# Altium schematic sheet TOP.SchDoc
size A4
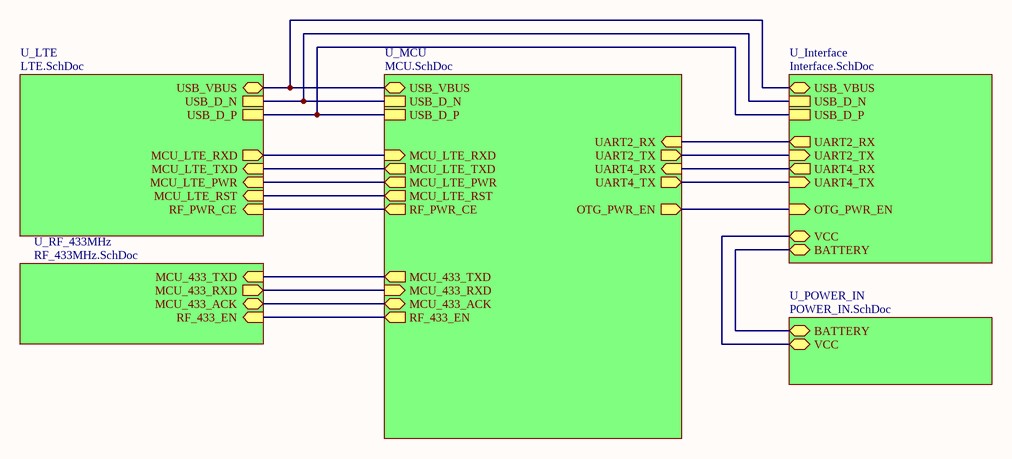
[diagram p0: TOP.SchDoc]

## Sub-sheets
U_Interface = Interface.SchDoc: USB_D_N, USB_D_P, UART2_TX (in), UART4_TX (in), UART2_RX (out), UART4_RX (out), OTG_PWR_EN (in), BATTERY (bidir), VCC (bidir), USB_VBUS (bidir)
U_LTE = LTE.SchDoc: USB_D_N, USB_D_P, MCU_LTE_RXD (out), MCU_LTE_TXD (in), MCU_LTE_PWR (in), MCU_LTE_RST (in), RF_PWR_CE (in), USB_VBUS (bidir)
U_MCU = MCU.SchDoc: USB_D_N, USB_D_P, MCU_LTE_TXD (out), MCU_LTE_RXD (in), MCU_LTE_PWR (out), MCU_LTE_RST (out), RF_PWR_CE (out), MCU_433_ACK (bidir), MCU_433_TXD (out), MCU_433_RXD (in), OTG_PWR_EN (out), UART2_RX (in), UART4_RX (in), UART2_TX (out), UART4_TX (out), RF_433_EN (out), USB_VBUS (bidir)
U_POWER_IN = POWER_IN.SchDoc: VCC (bidir), BATTERY (bidir)
U_RF_433MHz = RF_433MHz.SchDoc: MCU_433_ACK (bidir), MCU_433_TXD (in), MCU_433_RXD (out), RF_433_EN (in)

## Nets
(unnamed): sheet U_Interface/USB_D_N, sheet U_LTE/USB_D_N, sheet U_MCU/USB_D_N
(unnamed): sheet U_Interface/USB_D_P, sheet U_LTE/USB_D_P, sheet U_MCU/USB_D_P
(unnamed): sheet U_Interface/UART2_TX, sheet U_MCU/UART2_TX
(unnamed): sheet U_Interface/UART4_TX, sheet U_MCU/UART4_TX
(unnamed): sheet U_Interface/UART2_RX, sheet U_MCU/UART2_RX
(unnamed): sheet U_Interface/UART4_RX, sheet U_MCU/UART4_RX
(unnamed): sheet U_Interface/OTG_PWR_EN, sheet U_MCU/OTG_PWR_EN
(unnamed): sheet U_Interface/BATTERY, sheet U_POWER_IN/BATTERY
(unnamed): sheet U_Interface/VCC, sheet U_POWER_IN/VCC
(unnamed): sheet U_Interface/USB_VBUS, sheet U_LTE/USB_VBUS, sheet U_MCU/USB_VBUS
(unnamed): sheet U_LTE/MCU_LTE_RXD, sheet U_MCU/MCU_LTE_RXD
(unnamed): sheet U_LTE/MCU_LTE_TXD, sheet U_MCU/MCU_LTE_TXD
(unnamed): sheet U_LTE/MCU_LTE_PWR, sheet U_MCU/MCU_LTE_PWR
(unnamed): sheet U_LTE/MCU_LTE_RST, sheet U_MCU/MCU_LTE_RST
(unnamed): sheet U_LTE/RF_PWR_CE, sheet U_MCU/RF_PWR_CE
(unnamed): sheet U_MCU/MCU_433_ACK, sheet U_RF_433MHz/MCU_433_ACK
(unnamed): sheet U_MCU/MCU_433_TXD, sheet U_RF_433MHz/MCU_433_TXD
(unnamed): sheet U_MCU/MCU_433_RXD, sheet U_RF_433MHz/MCU_433_RXD
(unnamed): sheet U_MCU/RF_433_EN, sheet U_RF_433MHz/RF_433_EN